# Altium schematic sheet LacewingPXE_v3p1.SchDoc
size A3
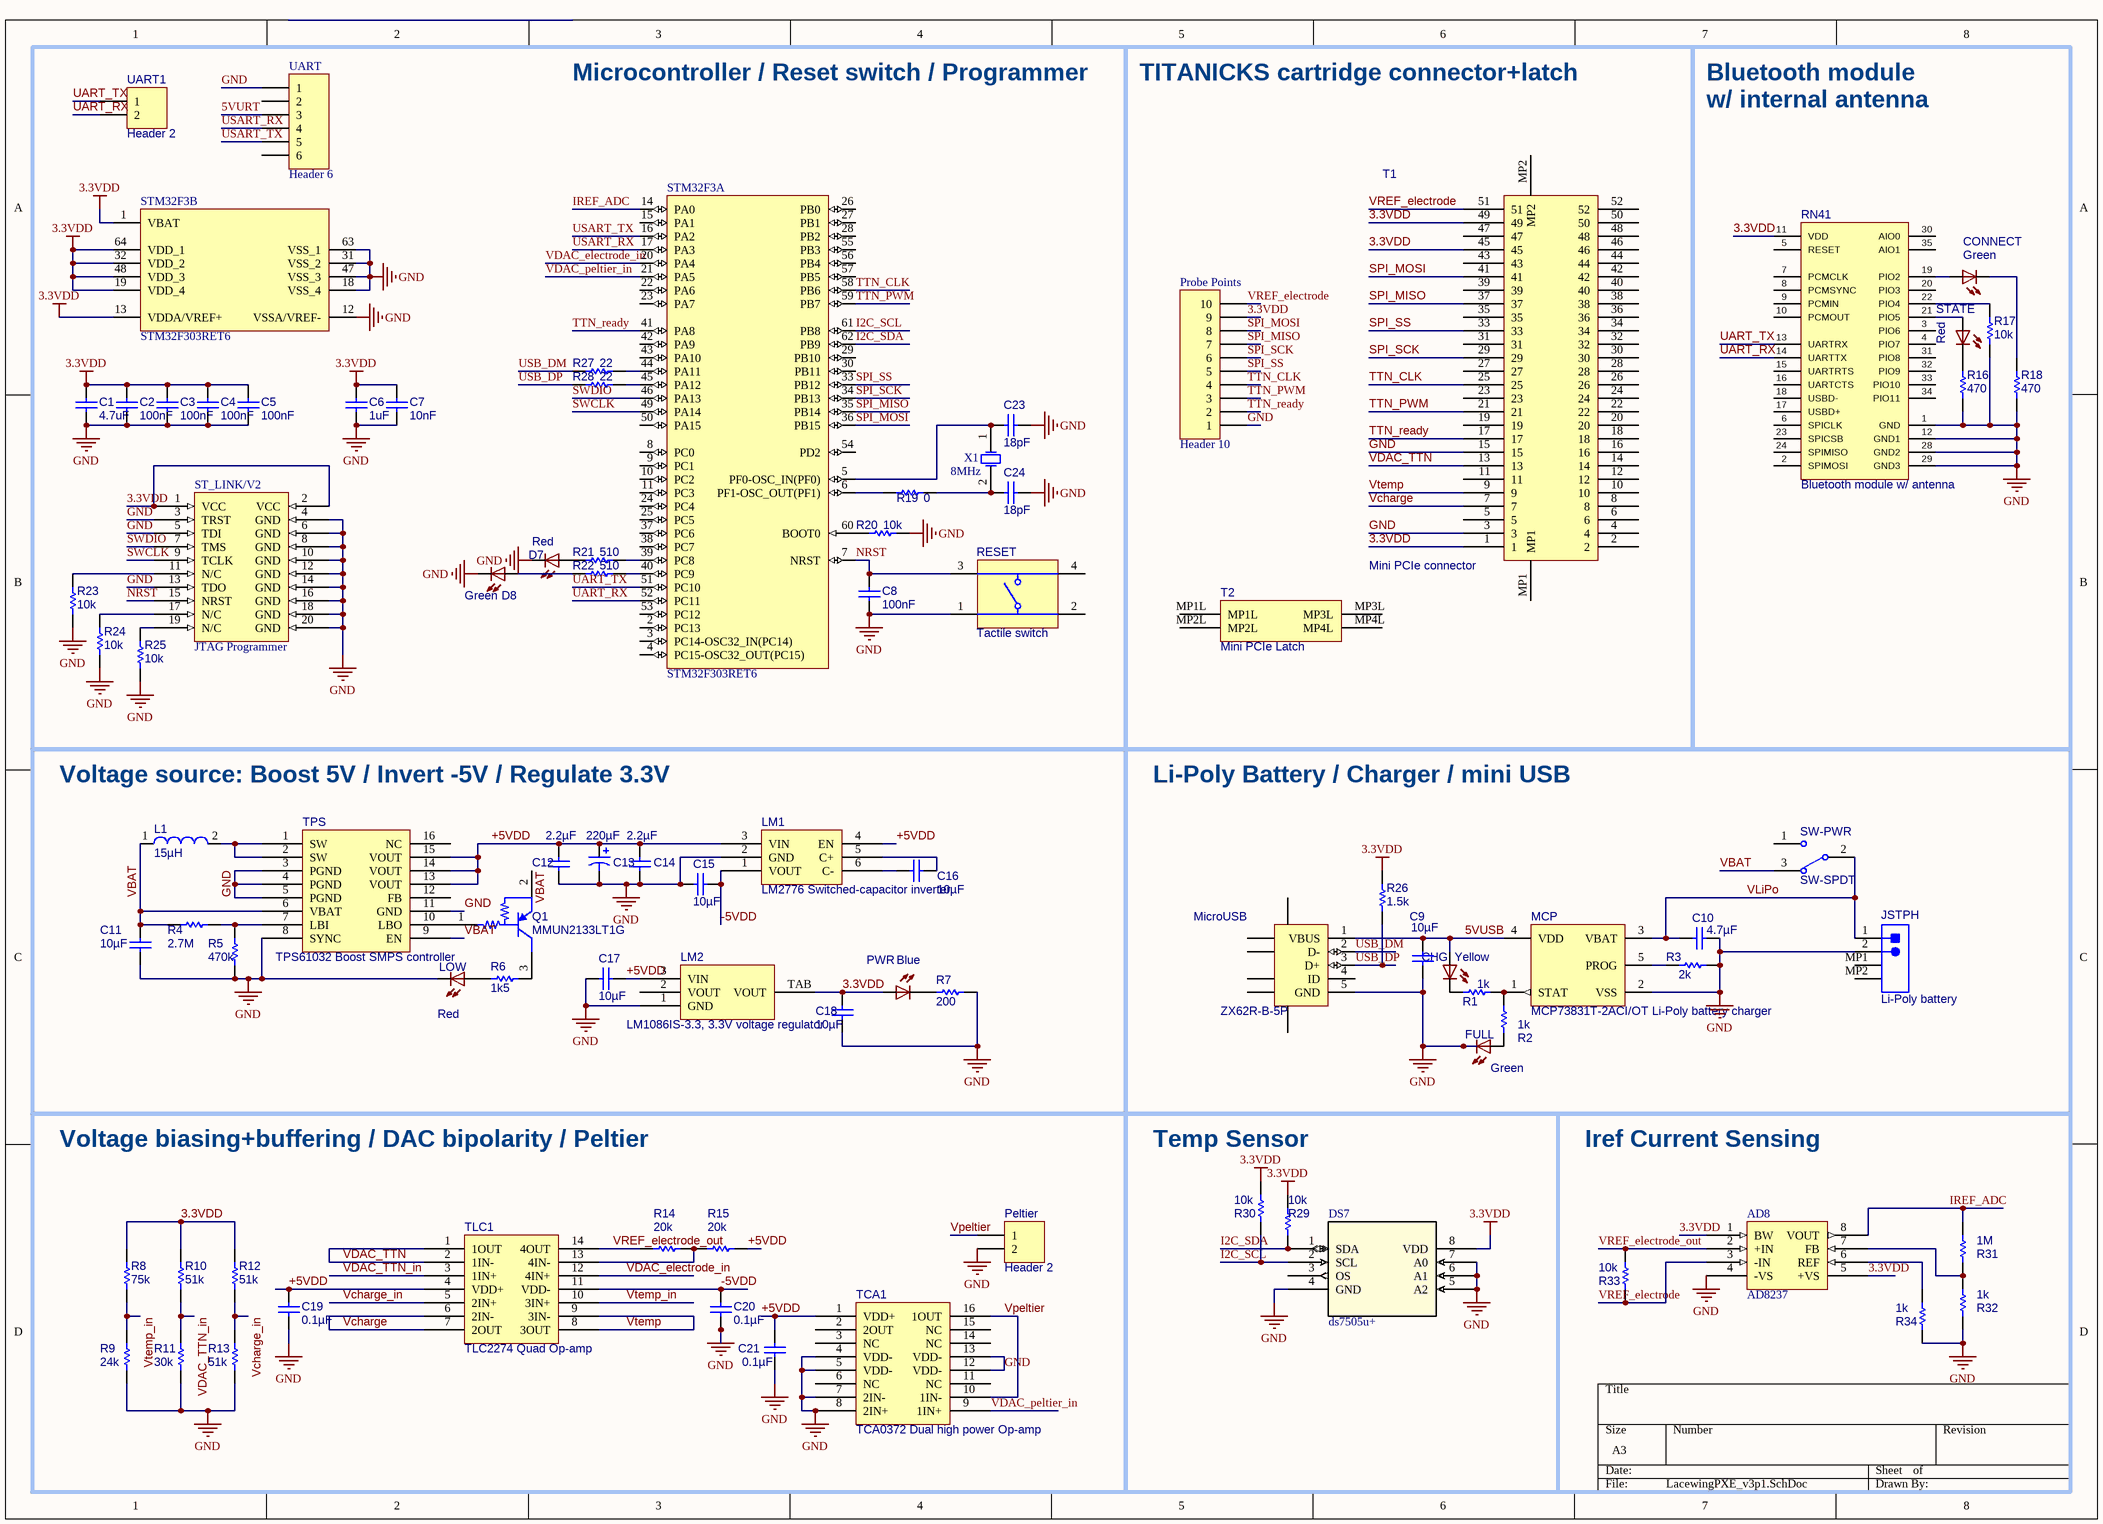
[diagram p0: LacewingPXE_v3p1.SchDoc]

## Parts
AD8  AD8237  [ADI-RM-8_N]
C1  4.7uF  [CAPC0603(1608)100_N]
C2  100nF  [CAPC0603(1608)100_N]
C3  100nF  [CAPC0603(1608)100_N]
C4  100nF  [CAPC0603(1608)100_N]
C5  100nF  [CAPC0603(1608)100_N]
C6  1uF  [CAPC0603(1608)100_N]
C7  10nF  [CAPC0603(1608)100_N]
C8  100nF  [CAPC0603(1608)100_N]
C9  10µF  [CAPC0805(2012)75_N]
C10  4.7µF  [CAPC0603(1608)100_N]
C11  10µF  [CAPC0805(2012)75_N]
C12  2.2µF  [CAPC0805(2012)75_N]
C13  220µF  [AVX-CAPC7343_V]
C14  2.2µF  [CAPC0805(2012)75_N]
C15  10µF  [CAPC0805(2012)75_N]
C16  10µF  [CAPC0805(2012)75_N]
C17  10µF  [CAPC0805(2012)75_N]
C18  10µF  [CAPC0805(2012)75_N]
C19  0.1µF  [CAPC0603(1608)100_N]
C20  0.1µF  [CAPC0603(1608)100_N]
C21  0.1µF  [CAPC0603(1608)100_N]
C23  18pF  [CAPC0603(1608)100_N]
C24  18pF  [CAPC0603(1608)100_N]
CHG  Yellow  [LED-0603]
CONNECT  Green  [LED-0603]
D7  Red  [LED-0603]
D8  Green  [LED-0603]
DS7  ds7505u+  [21-0036K]
FULL  Green  [LED-0603]
JSTPH  Li-Poly battery  [JST- S2B-PH-SM4-TB(LF)(SN)-2_V]
L1  15µH  [WE-PD 1050]
LM1  LM2776 Switched-capacitor inverter  [TI-DBV6_M]
LM2  LM1086IS-3.3, 3.3V voltage regulator  [TS3B_M]
LOW  Red  [LED-0603]
MCP  MCP73831T-2ACI/OT Li-Poly battery charger  [SOT-23-OT5_M]
MicroUSB  ZX62R-B-5P  [HIRO-ZX62R-B-5P_V]
Peltier  Header 2  [HDR1X2]
Probe_Points  Header 10  [HDR1X10]
PWR  Blue  [LED-0603]
Q1  MMUN2133LT1G  [ONSC-SOT-23-3-318-08_V]
R1  1k  [RESC0603(1608)_N]
R2  1k  [RESC0603(1608)_N]
R3  2k  [RESC0603(1608)_N]
R4  2.7M  [RESC0603(1608)_N]
R5  470k  [RESC0603(1608)_N]
R6  1k5  [RESC0603(1608)_N]
R7  200  [RESC0603(1608)_N]
R8  75k  [RESC0603(1608)_N]
R9  24k  [RESC0603(1608)_N]
R10  51k  [RESC0603(1608)_N]
R11  30k  [RESC0603(1608)_N]
R12  51k  [RESC0603(1608)_N]
R13  51k  [RESC0603(1608)_N]
R14  20k  [RESC0603(1608)_N]
R15  20k  [RESC0603(1608)_N]
R16  470  [RESC0603(1608)_N]
R17  10k  [RESC0603(1608)_N]
R18  470  [RESC0603(1608)_N]
R19  0  [RESC0603(1608)_N]
R20  10k  [RESC0603(1608)_N]
R21  510  [RESC0603(1608)_N]
R22  510  [RESC0603(1608)_N]
R23  10k  [RESC0603(1608)_N]
R24  10k  [RESC0603(1608)_N]
R25  10k  [RESC0603(1608)_N]
R26  1.5k  [RESC0603(1608)_N]
R27  22  [RESC0603(1608)_N]
R28  22  [RESC0603(1608)_N]
R29  10k  [RESC0603(1608)_N]
R30  10k  [RESC0603(1608)_N]
R31  1M  [RESC0603(1608)_N]
R32  1k  [RESC0603(1608)_N]
R33  10k  [RESC0603(1608)_N]
R34  1k  [RESC0603(1608)_N]
RESET  Tactile switch  [OMRON-B3F-1000-4_V]
RN41  Bluetooth module w/ antenna  [RN41]
ST_LINK/V2  JTAG Programmer  [JTAG2]
STATE  Red  [LED-0603]
STM32F3  STM32F303RET6  [STM-LQFP64_V]  (parts A,B of 2)
SW-PWR  SW-SPDT  [SWITCH SPDT CS12ANW03]
T1  Mini PCIe connector  [Molex Conn-67910]
T2  Mini PCIe Latch  [Molex Latch-48099]
TCA1  TCA0372 Dual high power Op-amp  [ONSC-SOIC-16-751G-03_V]
TLC1  TLC2274 Quad Op-amp  [TI-D14_M]
TPS  TPS61032 Boost SMPS controller  [PW0016A_M]
UART  Header 6  [HDR1X6]
UART1  Header 2  [HDR1X2]
X1  8MHz  [QCL]

## Blocks framed on the sheet
Microcontroller / Reset switch / Programmer: C1-C8 C23 C24 D7 D8 R19-R25 R27 R28 RESET ST_LINK/V2 STM32F3 UART UART1 X1
TITANICKS cartridge connector+latch: Probe_Points T1 T2
Voltage source: Boost 5V / Invert -5V / Regulate 3.3V: C11-C18 L1 LM1 LM2 LOW PWR Q1 R4-R7 TPS
Li-Poly Battery / Charger / mini USB: C9 C10 CHG FULL JSTPH MCP MicroUSB R1-R3 R26 SW-PWR
Voltage biasing+buffering / DAC bipolarity / Peltier: C19-C21 Peltier R8-R15 TCA1 TLC1

## Nets
3.3VDD: AD8.1(BW) AD8.5(+VS) C1.1 C2.1 C3.1 C4.1 C5.1 C6.1 C7.1 C18.2 DS7.8(VDD) LM2.TAB(VOUT) Probe_Points.9 PWR.A R8.1 R10.1 R12.1 R26.2 R29.2 R30.2 RN41.11(VDD) ST_LINK/V2.1(VCC) ST_LINK/V2.2(VCC) STM32F3.1(VBAT) STM32F3.13(VDDA/VREF+) STM32F3.19(VDD_4) STM32F3.32(VDD_2) STM32F3.48(VDD_3) STM32F3.64(VDD_1) T1.1 T1.45 T1.49
GND: AD8.4(-VS) C1.2 C2.2 C3.2 C4.2 C5.2 C6.2 C7.2 C8.2 C9.1 C10.1 C11.1 C12.1 C13.2 C14.1 C15.2 C17.2 C18.1 C19.1 C20.1 C21.1 C23.2 C24.2 D7.C D8.C DS7.4(GND) DS7.5(A2) DS7.6(A1) DS7.7(A0) FULL.C JSTPH.2 LM1.2(GND) LM2.1(GND) LOW.C MCP.2(VSS) MicroUSB.5(GND) Peltier.2 Probe_Points.1 R3.2 R5.2 R7.2 R9.2 R11.2 R13.2 R16.1 R17.1 R18.1 R20.2 R23.1 R24.1 R25.1 R32.1 R34.1 RESET.1 RN41.1(GND) RN41.12(GND1) RN41.28(GND2) RN41.29(GND3) ST_LINK/V2.3(TRST) ST_LINK/V2.4(GND) ST_LINK/V2.5(TDI) ST_LINK/V2.6(GND) ST_LINK/V2.8(GND) ST_LINK/V2.10(GND) ST_LINK/V2.12(GND) ST_LINK/V2.13(TDO) ST_LINK/V2.14(GND) ST_LINK/V2.16(GND) ST_LINK/V2.18(GND) ST_LINK/V2.20(GND) STM32F3.12(VSSA/VREF-) STM32F3.18(VSS_4) STM32F3.31(VSS_2) STM32F3.47(VSS_3) STM32F3.63(VSS_1) T1.3 T1.15 TCA1.4(VDD-) TCA1.5(VDD-) TCA1.7(2IN-) TCA1.8(2IN+) TCA1.12(VDD-) TCA1.13(VDD-) TPS.3(PGND) TPS.4(PGND) TPS.5(PGND) TPS.8(SYNC) TPS.11(GND) UART.1
5VURT: UART.3
5VUSB: C9.2 CHG.A MCP.4(VDD) MicroUSB.1(VBUS)
+5VDD: C12.2 C13.1 C14.2 C17.1 C19.2 C21.2 LM1.3(VIN) LM1.4(EN) LM2.3(VIN) R15.2 TCA1.1(VDD+) TLC1.4(VDD+) TPS.13(VOUT) TPS.14(VOUT) TPS.15(VOUT)
-5VDD: C15.1 C20.2 LM1.1(VOUT) TLC1.11(VDD-)
I2C_SCL: DS7.2(SCL) R30.1 STM32F3.61(PB8)
I2C_SDA: DS7.1(SDA) R29.1 STM32F3.62(PB9)
IREF_ADC: AD8.8(VOUT) R31.2 STM32F3.14(PA0)
NRST: C8.1 RESET.3 ST_LINK/V2.15(NRST) STM32F3.7(NRST)
SPI_MISO: Probe_Points.7 STM32F3.35(PB14) T1.37
SPI_MOSI: Probe_Points.8 STM32F3.36(PB15) T1.41
SPI_SCK: Probe_Points.6 STM32F3.34(PB13) T1.29
SPI_SS: Probe_Points.5 STM32F3.33(PB12) T1.33
SWCLK: ST_LINK/V2.9(TCLK) STM32F3.49(PA14)
SWDIO: ST_LINK/V2.7(TMS) STM32F3.46(PA13)
TTN_CLK: Probe_Points.4 STM32F3.58(PB6) T1.25
TTN_PWM: Probe_Points.3 STM32F3.59(PB7) T1.21
TTN_ready: Probe_Points.2 STM32F3.41(PA8) T1.17
UART_RX: RN41.14(UARTTX) STM32F3.52(PC11) UART1.2
UART_TX: RN41.13(UARTRX) STM32F3.51(PC10) UART1.1
USART_RX: STM32F3.17(PA3) UART.4
USART_TX: STM32F3.16(PA2) UART.5
USB_DM: MicroUSB.2(D-) R27.1
USB_DP: MicroUSB.3(D+) R26.1 R28.1
VBAT: C11.2 L1.1 Q1.2(E) R4.2 SW-PWR.3 TPS.6(VBAT) TPS.9(EN)
Vcharge: T1.7 TLC1.6(2IN-) TLC1.7(2OUT)
Vcharge_in: R12.2 R13.1 TLC1.5(2IN+)
VDAC_electrode_in: STM32F3.20(PA4) TLC1.12(4IN+)
VDAC_peltier_in: STM32F3.21(PA5) TCA1.9(1IN+)
VDAC_TTN: T1.13 TLC1.1(1OUT) TLC1.2(1IN-)
VDAC_TTN_in: R10.2 R11.1 TLC1.3(1IN+)
VLiPo: C10.2 JSTPH.1 MCP.3(VBAT) SW-PWR.2
Vpeltier: Peltier.1 TCA1.10(1IN-) TCA1.16(1OUT)
VREF_electrode: AD8.3(-IN) Probe_Points.10 R33.1 T1.51
VREF_electrode_out: AD8.2(+IN) R14.1 R33.2 TLC1.14(4OUT)
Vtemp: T1.9 TLC1.8(3OUT) TLC1.9(3IN-)
Vtemp_in: R8.2 R9.1 TLC1.10(3IN+)
NetAD8_6: AD8.6(REF) R34.2
NetAD8_7: AD8.7(FB) R31.1 R32.2
NetC16_1: C16.1 LM1.5(C+)
NetC16_2: C16.2 LM1.6(C-)
NetC23_1: C23.1 STM32F3.5(PF0-OSC_IN(PF0)) X1.1(OSC1)
NetC24_1: C24.1 R19.1 X1.2(OSC2)
NetCHG_C: CHG.C R1.1
NetCONNECT_A: CONNECT.A RN41.19(PIO2)
NetCONNECT_C: CONNECT.C R18.2
NetD7_A: D7.A R21.1
NetD8_A: D8.A R22.1
NetFULL_A: FULL.A R2.1
NetL1_2: L1.2 TPS.1(SW) TPS.2(SW)
NetLOW_A: LOW.A R6.1
NetMCP_1: MCP.1(STAT) R1.2 R2.2
NetMCP_5: MCP.5(PROG) R3.1
NetPWR_C: PWR.C R7.1
NetQ1_1: Q1.1(B) TPS.10(LBO)
NetQ1_3: Q1.3(C) R6.2
NetR4_1: R4.1 R5.1 TPS.7(LBI)
NetR14_2: R14.2 R15.1 TLC1.13(4IN-)
NetR16_2: R16.2 STATE.C
NetR17_2: R17.2 RN41.22(PIO4)
NetR19_2: R19.2 STM32F3.6(PF1-OSC_OUT(PF1))
NetR20_1: R20.1 STM32F3.60(BOOT0)
NetR21_2: R21.2 STM32F3.39(PC8)
NetR22_2: R22.2 STM32F3.40(PC9)
NetR23_2: R23.2 ST_LINK/V2.11(N/C)
NetR24_2: R24.2 ST_LINK/V2.17(N/C)
NetR25_2: R25.2 ST_LINK/V2.19(N/C)
NetR27_2: R27.2 STM32F3.44(PA11)
NetR28_2: R28.2 STM32F3.45(PA12)
NetRN41_21: RN41.21(PIO5) STATE.A

Not connected (* = marked no-connect by the designer): DS7 3(OS); JSTPH MP1 MP2; LM2 2(VOUT); MicroUSB 4(ID) 6(SHLD) 7(SHLD) 8(SHLD) 9(SHLD) 10(SHLD) 11(SHLD); RESET 2 4; RN41 2(SPIMOSI) 3(PIO6) 4(PIO7) 5(RESET) 6(SPICLK) 7(PCMCLK) 8(PCMSYNC) 9(PCMIN) 10(PCMOUT) 15(UARTRTS) 16(UARTCTS) 17(USBD+) 18(USBD-) 20(PIO3) 23(SPICSB) 24(SPIMISO) 30(AIO0) 31(PIO8) 32(PIO9) 33(PIO10) 34(PIO11) 35(AIO1); STM32F3 2(PC13) 3(PC14-OSC32_IN(PC14)) 4(PC15-OSC32_OUT(PC15)) 8(PC0) 9(PC1) 10(PC2) 11(PC3) 15(PA1) 22(PA6) 23(PA7) 24(PC4) 25(PC5) 26(PB0) 27(PB1) 28(PB2) 29(PB10) 30(PB11) 37(PC6) 38(PC7) 42(PA9) 43(PA10) 50(PA15) 53(PC12) 54(PD2) 55(PB3) 56(PB4) 57(PB5); SW-PWR 1; T1 2 4 5 6 8 10 11 12 14 16 18 19 20 22 23 24 26 27 28 30 31 32 34 35 36 38 39 40 42 43 44 46 47 48 50 52 MP1 MP2; T2 MP1L MP2L MP3L MP4L; TCA1 2(2OUT) 3(NC) 6(NC) 11(NC) 14(NC) 15(NC); TPS 12(FB) 16(NC); UART 2 6

## Notes on the sheet
- Bluetooth module
- w/ internal antenna
- Temp Sensor
- Iref Current Sensing

## Library data of the parts
C1-C8 C23 C24 = CMP-1035-00032-1: Ceramic CAP0603 (1608 Metric) Thickness 1mm SMD; Case-EIA: 0603; Farnell Order: 1759122
C9 C11 C12 C14-C18 = CMP-1036-00002-1: Ceramic CAP0805 (2012 Metric) Thickness 0.75mm SMD; Case-EIA: 0805; Rated Voltage: 10 V
  C9 C11 C15-C18: Farnell Order: 2533951
  C12 C14: Farnell Order: 2320829
C10 = CMP-1035-00032-1: Ceramic CAP0603 (1608 Metric) Thickness 1mm SMD; Case-EIA: 0603; Rated Voltage: 10 V; Farnell Order: 2320818
C13 = CMP-0279-00002-1: Capacitor, Tantalum, 220uF 10% 10V MCCT-D (7343-31); PartNumber: TAJD227K010R; Manufacturer: AVX; Polarity: Polarized; Technology: Tantalum; Tolerance: 10%; Rated Voltage: 10V; PackageDescription: 2-Pin SMT Capacitor, 7.3 x 4.3 mm Body; Farnell Order: 2333072
C19-C21 = CAP: Ceramic CAP0603 (1608 Metric) Thickness 1mm SMD; Case-EIA: 0603; Farnell Order: 1759122
CHG CONNECT FULL LOW STATE = LED0603: LED SMD 0603
  CHG: Farnell Order: 2335795
  CONNECT FULL: Farnell Order: 2099223
  LOW STATE: Farnell Order: 2335810
D7 D8 PWR = LED0603: LED SMD 0603; RS Order: 654-5666
DS7 = ds7505u+: No Description Available; Vendor: Maxim Integrated Products; Built_By: EMA_UL_Team; Type: DEV; Manufacturer_Part_Number: ds7505u+; Copyright: Copyright (C) 2018 Accelerated Designs. All rights reserved; RefDes: RefDes; Value: Value
JSTPH = CN-1P-2M-R2: JST PH 2-pin 2-holder SMD; Farnell Order: 9492615
L1 = CMP-1396-00032-1: SMD-Shielded Power Inductor WE-PD 7447714150, L=15 µH; Farnell Order: 2082678
LM1 = LM2776: Farnell Order: 2498456
LM2 = LM1086IS-3.3: Farnell Order: 9490647
MCP = CMP-0133-00143-1: Miniature Single-Cell, Fully Integrated Li-Ion, Li-Polymer Charge Management Controller, 4.2V, 5-Pin SOT-23, Industrial Temperature, Tape and Reel; Farnell Order: 1332158
MicroUSB = CMP-0031-00001-1: Connector; USBMicro-B,Reverse type, SMT; 5 Position; Right Angle; DatasheetVersion: 08/2010; Operating Temperature: -30 to 85 degC; Mounting Technology: Surface Mount; PartNumber: ZX62R-B-5P; PackageReference: ZX62R-B-5P; ComponentLink2URL: http://www.hirose.co.jp/cataloge_hp/e24200011.pdf; ComponentLink1URL: http://www.hirose.com/â€Ž; ComponentLink2Description: Datasheet; PackageDescription: 5-Pin USB Micro-B R/A Connector; ComponentLink1Description: Manufacturer URL
Peltier UART1 = Header 2: Header, 2-Pin; LatestRevisionDate: 17-Jul-2002; LatestRevisionNote: Re-released for DXP Platform.; Publisher: Altium Limited
Probe_Points = Header 10: Header, 10-Pin; LatestRevisionDate: 17-Jul-2002; LatestRevisionNote: Re-released for DXP Platform.; Publisher: Altium Limited
Q1 = CMP-0630-00284-1: Digital Transistor (BRT), R1=4.7 kOhm, R2=47 kOhm, PNP Transistor, 3-Pin SOT-23, Pb-Free, Tape and Reel; Farnell Order: 2317628
R1-R34 = CMP-1012-00514-1: RES0603 (1608 Metric)  SMD; Case-EIA: 0603
  R1 R16 R18: Farnell Order: 2130829
  R2 R6 R29-R34: Farnell Order: 2130855
  R3: Farnell Order: 2130881
  R4: Farnell Order: 2141592
  R5: Farnell Order: 2131071
  R7 R19-R28: Farnell Order: 2130797
  R8: Farnell Order: 2350912
  R9: Farnell Order: 2130969
  R10 R12 R13: Farnell Order: 2350847
  R11: Farnell Order: 2130976
  R14 R15: Farnell Order: 2130962
  R17: Farnell Order: 2130939
RESET = SW-SPST-4_A: ORMON B3F-10XX; Mouser Order: 653-B3F-1022
RN41 = BLUETOOTH-RN41: Bluetooth SMD module
ST_LINK/V2 = JTAG
STM32F3 = STM32F303RBT6_1: ARM Cortex-M4 32-bit MCU, 128 KB Flash, 32 KB Internal RAM, 52 I/Os, 64-pin LQFP, -40 to 85 degC, Tray; D/A Converter: 2x12-bit (2 Channel); FLASH Size (Prog) (kB): 128; I/Os (High Current): 52; Internal RAM Size (kB): 32; Operating Frequency(F) (Processor speed) (MHz): 72; Supply Voltage(Vcc) min (V): 2; DatasheetVersion: Rev. 6; PackageVersion: Rev. 4, 06/2013; PackageReference: LQFP64; PackageDescription: 64-Pin Low Profile Quad Flat Package, 10 x 10 mm Body, 0.5 mm Pitch; Supplier 1: Digi-Key; Supplier Part Number 1: STM32F303RBT6-ND; Supplier 2: Farnell; Supplier Part Number 2: 2333255; Supplier 3: Newark; Supplier Part Number 3: 99W9873; Supplier 4: Newark; Supplier Part Number 4: 66W7287; Supplier 5: Mouser; Supplier Part Number 5: 511-STM32F303RBT6; Core: ARM Cortex-M4; Packing: Tray; Mounting Technology: Surface Mount; PartNumber: STM32F303RBT6; ComponentLink1Description: Manufacturer URL; ComponentLink1URL: http://www.st.com/web/en/home.html; ComponentLink2Description: Datasheet; ComponentLink2URL: http://www.st.com/st-web-ui/static/active/en/resource/technical/document/datasheet/DM00058181.pdf; ComponentLink3Description: Package Specification; ComponentLink3URL: http://www.st.com/st-web-ui/static/active/en/resource/technical/document/datasheet/DM00037051.pdf
SW-PWR = SW-SPDT: Switch SPDT CS12ANW03; Mouser Order: 633-CS12ANW03
TCA1 = TCA0372: Farnell Order: 1468783
TLC1 = TLC2274: Farnell Order: 2769370
TPS = TPS61032: Farnell Order: 1207333
UART = Header 6: Header, 6-Pin; LatestRevisionDate: 17-Jul-2002; LatestRevisionNote: Re-released for DXP Platform.; Publisher: Altium Limited
X1 = XTAL: Crystal Oscillator; Published: 8-Jun-2000; LatestRevisionDate: 17-Jul-2002; LatestRevisionNote: Re-released for DXP Platform.; PackageReference: R38; Publisher: Altium Limited; PackageDescription: Crystal, Thru-Hole; 2 Leads; Body 3.1 x 8.2 mm (Dia.xH)